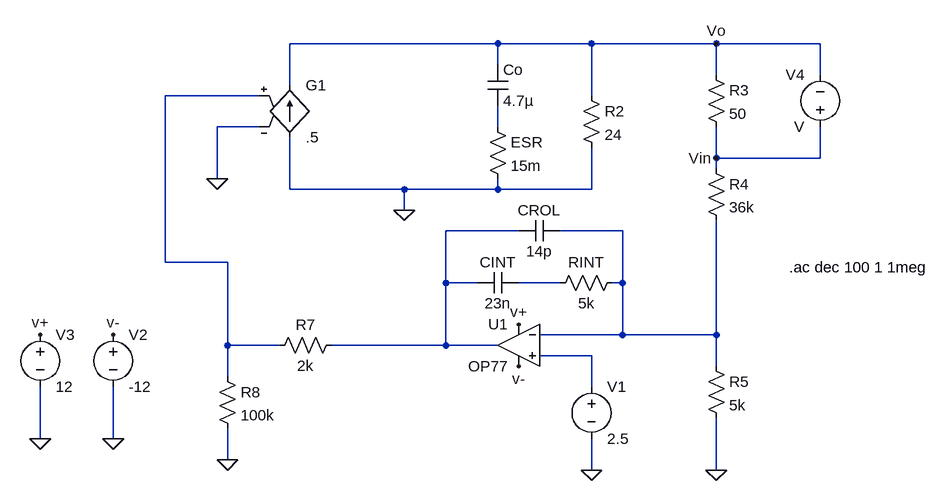
[diagram p0: schematic Draft1.asc]
Draft1.asc, the LTspice schematic file:
Version 4
SHEET 1 1092 692
WIRE 416 16 96 16
WIRE 560 16 416 16
WIRE 752 16 560 16
WIRE 912 16 752 16
WIRE 416 48 416 16
WIRE 752 64 752 16
WIRE 912 64 912 16
WIRE 96 80 96 16
WIRE 48 96 -96 96
WIRE 560 96 560 16
WIRE 48 144 -16 144
WIRE 416 144 416 112
WIRE 752 192 752 144
WIRE 912 192 912 144
WIRE 912 192 752 192
WIRE 752 208 752 192
WIRE -16 224 -16 144
WIRE 96 240 96 160
WIRE 272 240 96 240
WIRE 416 240 416 224
WIRE 416 240 272 240
WIRE 560 240 560 176
WIRE 560 240 416 240
WIRE 272 272 272 240
WIRE 448 304 336 304
WIRE 608 304 512 304
WIRE -96 352 -96 96
WIRE 0 352 -96 352
WIRE 336 384 336 304
WIRE 384 384 336 384
WIRE 512 384 448 384
WIRE 608 384 608 304
WIRE 608 384 592 384
WIRE 608 464 608 384
WIRE 608 464 480 464
WIRE 752 464 752 288
WIRE 752 464 608 464
WIRE 0 480 0 352
WIRE 80 480 0 480
WIRE 336 480 336 384
WIRE 336 480 160 480
WIRE 416 480 336 480
WIRE 560 496 480 496
WIRE 752 512 752 464
WIRE 0 528 0 480
WIRE 560 544 560 496
WIRE -288 624 -288 544
WIRE -176 624 -176 544
WIRE 0 656 0 608
WIRE 560 672 560 624
WIRE 752 672 752 592
FLAG 560 672 0
FLAG 752 672 0
FLAG -16 224 0
FLAG 448 448 v+
FLAG 448 512 v-
FLAG 272 272 0
FLAG 0 656 0
FLAG -176 624 0
FLAG -288 624 0
FLAG -176 464 v-
FLAG -288 464 v+
FLAG 752 16 Vo
FLAG 752 192 Vin
SYMBOL g 96 64 R0
SYMATTR InstName G1
SYMATTR Value .5
SYMBOL cap 400 48 R0
SYMATTR InstName Co
SYMATTR Value 4.7µ
SYMBOL res 400 128 R0
SYMATTR InstName ESR
SYMATTR Value 15m
SYMBOL res 544 80 R0
SYMATTR InstName R2
SYMATTR Value 24
SYMBOL res 736 48 R0
SYMATTR InstName R3
SYMATTR Value 50
SYMBOL res 736 192 R0
SYMATTR InstName R4
SYMATTR Value 36k
SYMBOL res 736 496 R0
SYMATTR InstName R5
SYMATTR Value 5k
SYMBOL OpAmps\\OP77 448 416 M0
SYMATTR InstName U1
SYMBOL voltage 560 528 R0
SYMATTR InstName V1
SYMATTR Value 2.5
SYMBOL res 608 368 R90
WINDOW 0 0 56 VBottom 2
WINDOW 3 32 56 VTop 2
SYMATTR InstName RINT
SYMATTR Value 5k
SYMBOL cap 448 368 R90
WINDOW 0 0 32 VBottom 2
WINDOW 3 32 32 VTop 2
SYMATTR InstName CINT
SYMATTR Value 23n
SYMBOL cap 512 288 R90
WINDOW 0 0 32 VBottom 2
WINDOW 3 32 32 VTop 2
SYMATTR InstName CROL
SYMATTR Value 14p
SYMBOL res 176 464 R90
WINDOW 0 0 56 VBottom 2
WINDOW 3 32 56 VTop 2
SYMATTR InstName R7
SYMATTR Value 2k
SYMBOL res -16 512 R0
SYMATTR InstName R8
SYMATTR Value 100k
SYMBOL voltage -176 448 R0
SYMATTR InstName V2
SYMATTR Value -12
SYMBOL voltage -288 448 R0
SYMATTR InstName V3
SYMATTR Value 12
SYMBOL voltage 912 160 R180
WINDOW 0 24 96 Left 2
WINDOW 3 24 16 Left 2
SYMATTR InstName V4
TEXT 864 360 Left 2 !.ac dec 100 1 1meg

The netlist it stands for:
* Draft1.asc
G1 0 Vo N001 0 .5
Co Vo N002 4.7µ
R§ESR N002 0 15m
R2 Vo 0 24
R3 Vo Vin 50
R4 Vin N004 36k
R5 N004 0 5k
XU1 N006 N004 v+ v- N003 OP77  ; pins In+ In- V+ V- OUT
V1 N006 0 2.5
RINT N004 N005 5k
CINT N005 N003 23n
CROL N004 N003 14p
R7 N003 N001 2k
R8 N001 0 100k
V2 v- 0 -12
V3 v+ 0 12
V4 Vin Vo V
.ac dec 100 1 1meg
.lib ADI.lib
.backanno
.end